# Altium schematic sheet fishbotv0.1_2022-03-06.schdoc
size 284 x 203 mm
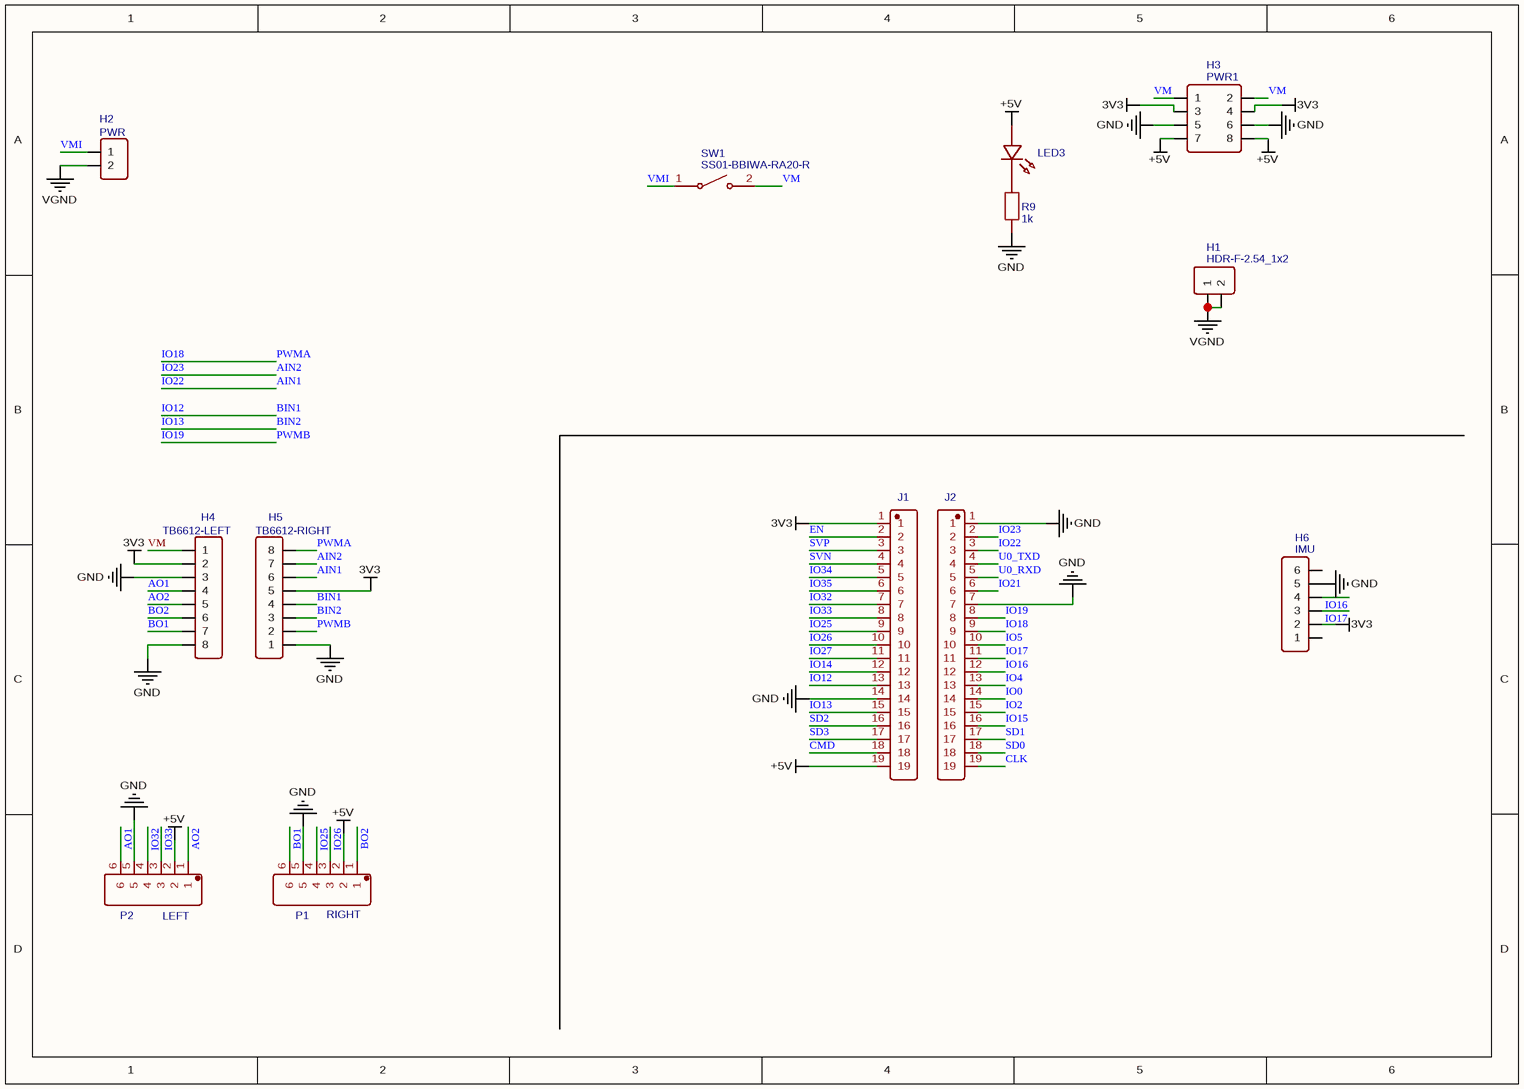
[diagram p0: fishbotv0.1_2022-03-06.schdoc]

## Parts
H1  HDR-F-2.54_1x2  [HDR-F-2.54_1X2]
H2  PWR  [HDR-F-2.54_1X2]
H3  PWR1  [HDR-F-2.54_2X4]
H4  TB6612-LEFT  [HDR-F-2.54_1X8]
H5  TB6612-RIGHT  [HDR-F-2.54_1X8]
H6  IMU  [HDR-F-2.54_1X6]
J1  Header-Male-2.54_1x19  [HDR-TH_19P-P2.54-V-M]  (value not drawn)
J2  Header-Male-2.54_1x19  [HDR-TH_19P-P2.54-V-M]  (value not drawn)
LED3  LED-0603_R  [LED0603_RED]  (value not drawn)
P1  RIGHT  [CONN-TH_6P-P2.54_2.54-6P]
P2  LEFT  [CONN-TH_6P-P2.54_2.54-6P]
R9  1k  [R0805]
SW1  SS01-BBIWA-RA20-R  [SW-TH_SS01-BBIWA-RA20-R]

## Nets
3V3: H3.3 H3.4 H4.2 H5.5 H6.2 J1.1
+5V: H3.7 H3.8 J1.19 LED3.1 P1.2 P2.2
GND: H3.5 H3.6 H4.3 H4.8 H5.1 H6.5 J1.14 J2.1 J2.7 P1.5 P2.5 R9.2
VGND: H1.1 H1.2 H2.2
AIN1: H5.6 J2.3  [also labelled IO22]
AIN2: H5.7 J2.2  [also labelled IO23]
AO1: H4.4 P2.6
AO2: H4.5 P2.1
BIN1: H5.4 J1.13  [also labelled IO12]
BIN2: H5.3 J1.15  [also labelled IO13]
BO1: H4.7 P1.6
BO2: H4.6 P1.1
CLK: J2.19
CMD: J1.18
EN: J1.2
IO0: J2.14
IO2: J2.15
IO4: J2.13
IO5: J2.10
IO14: J1.12
IO15: J2.16
IO16: H6.4 J2.12
IO17: H6.3 J2.11
IO18: H5.8 J2.9  [also labelled PWMA]
IO19: H5.2 J2.8  [also labelled PWMB]
IO21: J2.6
IO25: J1.9 P1.4
IO26: J1.10 P1.3
IO27: J1.11
IO32: J1.7 P2.4
IO33: J1.8 P2.3
IO34: J1.5
IO35: J1.6
SD0: J2.18
SD1: J2.17
SD2: J1.16
SD3: J1.17
SVN: J1.4
SVP: J1.3
U0_RXD: J2.5
U0_TXD: J2.4
VM: H3.1 H3.2 H4.1 SW1.2
VMI: H2.1 SW1.1
NetLED3_2: LED3.2 R9.1

Not connected (* = marked no-connect by the designer): H6 1 6

## Library data of the parts
H1 = HDR-F-2.54_1x2: Contributor: LCEDA_Lib; BOM_Supplier Part: C49661; BOM_Supplier: LCSC; spicePre: H; spiceSymbolName: HDR-F-2.54_1x2
H2 = PWR: Contributor: LCEDA_Lib; BOM_Supplier Part: C49661; BOM_Supplier: LCSC; spicePre: H; spiceSymbolName: HDR-F-2.54_1x2
H3 = PWR1: Contributor: LCEDA_Lib; BOM_Supplier Part: C239344; BOM_Supplier: LCSC; spicePre: H; spiceSymbolName: HDR-F-2.54_2x4
H4 = TB6612-LEFT: Contributor: LCEDA_Lib; BOM_Supplier Part: C225505; BOM_Supplier: LCSC; spicePre: H; spiceSymbolName: HDR-F-2.54_1x8
H5 = TB6612-RIGHT: Contributor: LCEDA_Lib; BOM_Supplier Part: C225505; BOM_Supplier: LCSC; spicePre: H; spiceSymbolName: HDR-F-2.54_1x8
H6 = IMU: Contributor: LCEDA_Lib; BOM_Supplier Part: C40877; BOM_Supplier: LCSC; spicePre: H; spiceSymbolName: HDR-F-2.54_1x6
J1 J2 = Header-Male-2.54_1x19: BOM_Manufacturer: BOOMELE; BOM_Manufacturer Part: 2.54mm 1*20PHeader; Contributor: shiyindebcd; Package Display: No; BOM_Supplier: LCSC; image: //image.lceda.cn/szlcsc/C50981.jpg; BOM_Supplier Part: C50981; spicePre: J; spiceSymbolName: Header-Male-2.54_1x19
LED3 = LED-0603_R: BOM_Manufacturer: EVERLIGHT(台湾亿光); BOM_Manufacturer Part: 19-217/R6C-AL1M2VY/3T; Contributor: LCEDA_01; BOM_Supplier Part: C72044; BOM_Supplier: LCSC; spicePre: L; spiceSymbolName: LED-0603_R
P1 = RIGHT: BOM_Manufacturer: BOOMELE; BOM_Manufacturer Part: 2.54pitch 6P; spicePre: X; BOM_Supplier: LCSC; BOM_Supplier Part: C24361; BOM_JLCPCB Part Class: Extended Part; spiceSymbolName: 2.54pitch 6P
P2 = LEFT: BOM_Manufacturer: BOOMELE; BOM_Manufacturer Part: 2.54pitch 6P; spicePre: X; BOM_Supplier: LCSC; BOM_Supplier Part: C24361; BOM_JLCPCB Part Class: Extended Part; spiceSymbolName: 2.54pitch 6P
R9 = 1k: nameAlias: Value(Ω); Contributor: LCEDA_Lib; spicePre: R; spiceSymbolName: R_0603_EU
SW1 = SS01-BBIWA-RA20-R: BOM_Manufacturer: Legion; Contributor: LCSC; BOM_Supplier: LCSC; BOM_Supplier Part: C309065; BOM_Manufacturer Part: SS01-BBIWA-RA20-R; BOM_JLCPCB Part Class: Extended Part; spicePre: S; spiceSymbolName: SS01-BBIWA-RA20-R